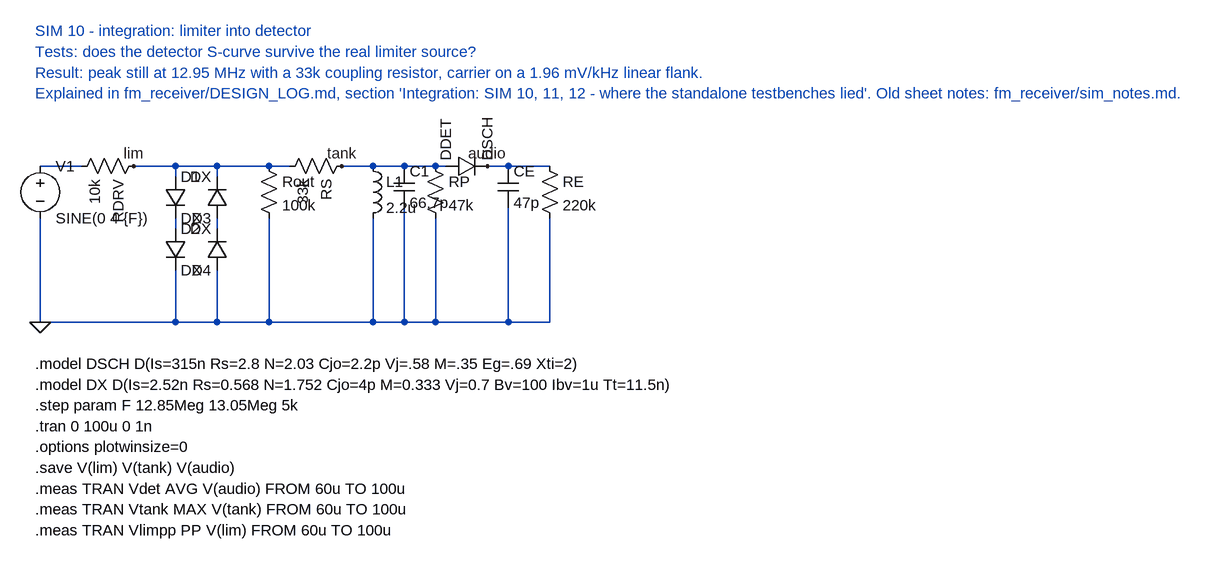
[diagram p0: schematic sim10_limiter_detector.asc]
sim10_limiter_detector.asc, the LTspice schematic file:
Version 4
SHEET 1 1200 800
WIRE 80 96 144 96
WIRE 80 176 80 336
WIRE 224 96 464 96
WIRE 288 96 288 112
WIRE 288 176 288 192
WIRE 288 256 288 336
WIRE 352 96 352 112
WIRE 352 176 352 192
WIRE 352 256 352 336
WIRE 432 176 432 336
WIRE 544 96 704 96
WIRE 592 176 592 336
WIRE 640 160 640 336
WIRE 688 176 688 336
WIRE 768 96 864 96
WIRE 800 160 800 336
WIRE 864 176 864 336
WIRE 80 336 288 336
WIRE 288 336 352 336
WIRE 352 336 432 336
WIRE 432 336 592 336
WIRE 592 336 640 336
WIRE 640 336 688 336
WIRE 688 336 800 336
WIRE 800 336 864 336
FLAG 80 336 0
FLAG 224 96 lim
FLAG 544 96 tank
FLAG 768 96 audio
SYMBOL voltage 80 80 R0
SYMATTR InstName V1
SYMATTR Value SINE(0 4 {F})
SYMBOL res 240 80 R90
SYMATTR InstName RDRV
SYMATTR Value 10k
SYMBOL diode 272 112 R0
SYMATTR InstName D1
SYMATTR Value DX
SYMBOL diode 272 192 R0
SYMATTR InstName D2
SYMATTR Value DX
SYMBOL diode 368 176 R180
SYMATTR InstName D3
SYMATTR Value DX
SYMBOL diode 368 256 R180
SYMATTR InstName D4
SYMATTR Value DX
SYMBOL res 416 80 R0
SYMATTR InstName Rout
SYMATTR Value 100k
SYMBOL res 560 80 R90
SYMATTR InstName RS
SYMATTR Value 33k
SYMBOL ind 576 80 R0
SYMATTR InstName L1
SYMATTR Value 2.2u
SYMBOL cap 624 96 R0
SYMATTR InstName C1
SYMATTR Value 66.7p
SYMBOL res 672 80 R0
SYMATTR InstName RP
SYMATTR Value 47k
SYMBOL diode 704 112 R270
SYMATTR InstName DDET
SYMATTR Value DSCH
SYMBOL cap 784 96 R0
SYMATTR InstName CE
SYMATTR Value 47p
SYMBOL res 848 80 R0
SYMATTR InstName RE
SYMATTR Value 220k
TEXT 72 400 Left 2 !.model DSCH D(Is=315n Rs=2.8 N=2.03 Cjo=2.2p Vj=.58 M=.35 Eg=.69 Xti=2)
TEXT 72 432 Left 2 !.model DX D(Is=2.52n Rs=0.568 N=1.752 Cjo=4p M=0.333 Vj=0.7 Bv=100 Ibv=1u Tt=11.5n)
TEXT 72 464 Left 2 !.step param F 12.85Meg 13.05Meg 5k
TEXT 72 496 Left 2 !.tran 0 100u 0 1n
TEXT 72 528 Left 2 !.options plotwinsize=0
TEXT 72 560 Left 2 !.save V(lim) V(tank) V(audio)
TEXT 72 592 Left 2 !.meas TRAN Vdet AVG V(audio) FROM 60u TO 100u
TEXT 72 624 Left 2 !.meas TRAN Vtank MAX V(tank) FROM 60u TO 100u
TEXT 72 656 Left 2 !.meas TRAN Vlimpp PP V(lim) FROM 60u TO 100u
TEXT 72 -112 Left 2 ;SIM 10 - integration: limiter into detector
TEXT 72 -80 Left 2 ;Tests: does the detector S-curve survive the real limiter source?
TEXT 72 -48 Left 2 ;Result: peak still at 12.95 MHz with a 33k coupling resistor, carrier on a 1.96 mV/kHz linear flank.
TEXT 72 -16 Left 2 ;Explained in fm_receiver/DESIGN_LOG.md, section 'Integration: SIM 10, 11, 12 - where the standalone testbenches lied'. Old sheet notes: fm_receiver/sim_notes.md.

The netlist it stands for:
* sim10_limiter_detector.asc
V1 N001 0 SINE(0 4 {F})
RDRV lim N001 10k
D1 lim N002 DX
D2 N002 0 DX
D3 N003 lim DX
D4 0 N003 DX
Rout lim 0 100k
RS tank lim 33k
L1 tank 0 2.2u
C1 tank 0 66.7p
RP tank 0 47k
DDET tank audio DSCH
CE audio 0 47p
RE audio 0 220k
.model D D
.lib standard.dio
.model DSCH D(Is=315n Rs=2.8 N=2.03 Cjo=2.2p Vj=.58 M=.35 Eg=.69 Xti=2)
.model DX D(Is=2.52n Rs=0.568 N=1.752 Cjo=4p M=0.333 Vj=0.7 Bv=100 Ibv=1u Tt=11.5n)
.step param F 12.85Meg 13.05Meg 5k
.tran 0 100u 0 1n
.options plotwinsize=0
.save V(lim) V(tank) V(audio)
.meas TRAN Vdet AVG V(audio) FROM 60u TO 100u
.meas TRAN Vtank MAX V(tank) FROM 60u TO 100u
.meas TRAN Vlimpp PP V(lim) FROM 60u TO 100u
* SIM 10 - integration: limiter into detector
* Tests: does the detector S-curve survive the real limiter source?
* Result: peak still at 12.95 MHz with a 33k coupling resistor, carrier on a 1.96 mV/kHz linear flank.
* Explained in fm_receiver/DESIGN_LOG.md, section 'Integration: SIM 10, 11, 12 - where the standalone testbenches lied'. Old sheet notes: fm_receiver/sim_notes.md.
.backanno
.end